# EAGLE schematic trig3_board_marc1_de0-nano (EAGLE 9.5.2)
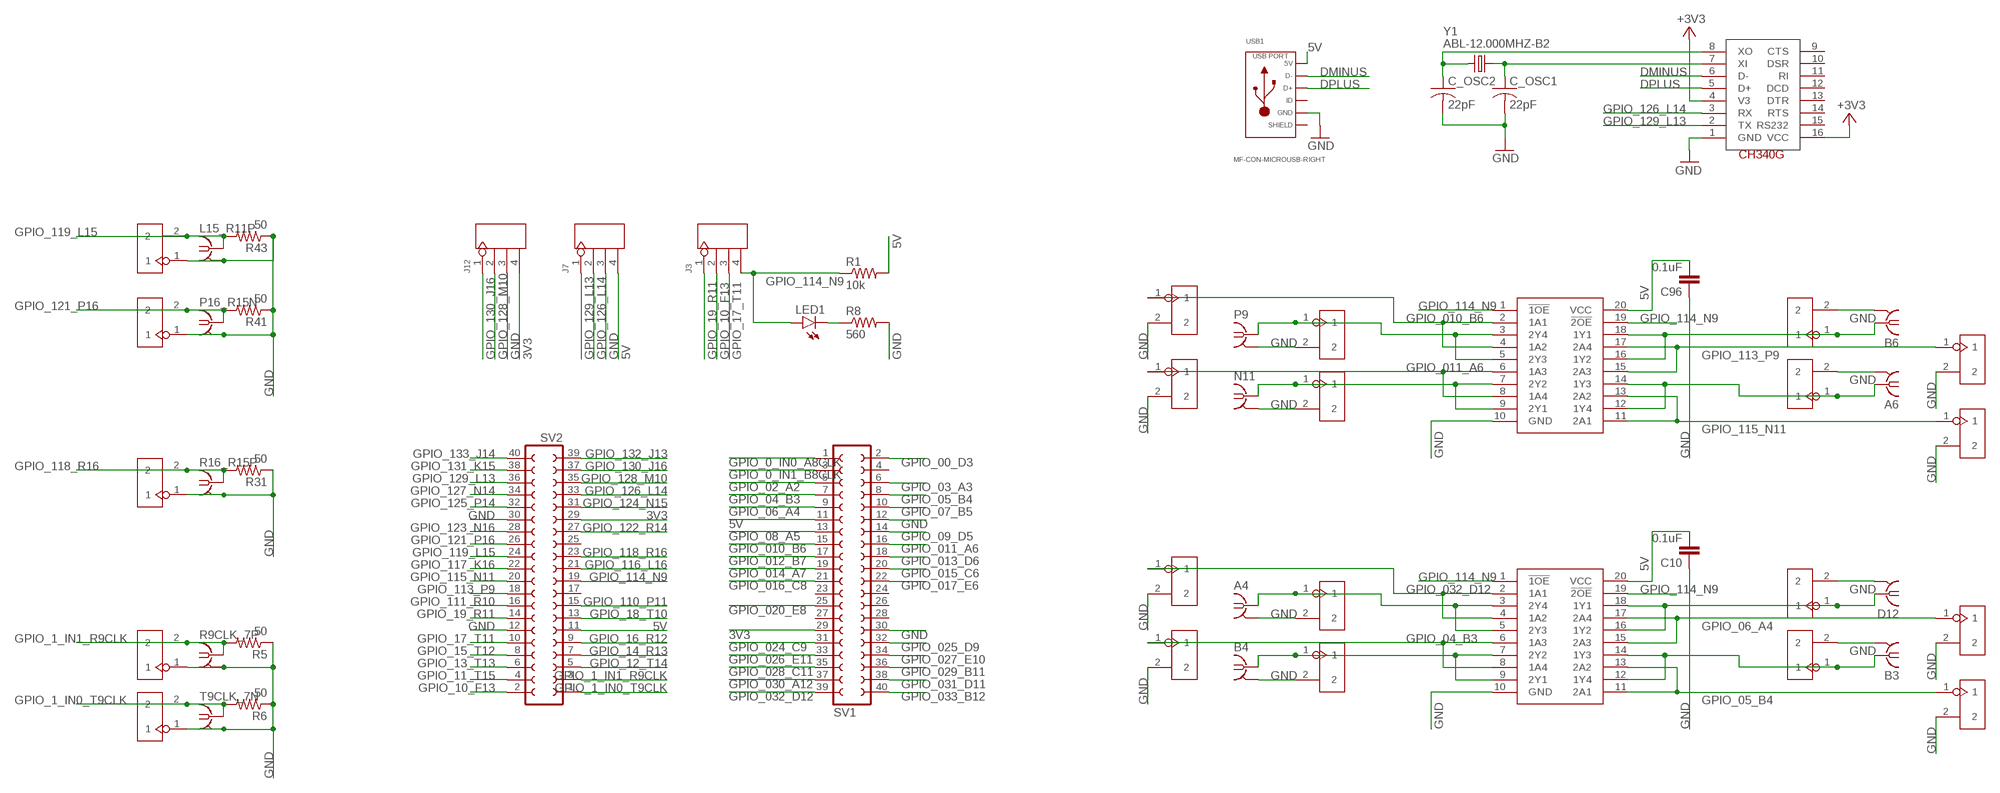
[diagram p0: schematic, sheet 1]

## Parts
A4  BU-SMB-V  [BU-SMB-V]
A6  BU-SMB-V  [BU-SMB-V]
B3  BU-SMB-V  [BU-SMB-V]
B4  BU-SMB-V  [BU-SMB-V]
B6  BU-SMB-V  [BU-SMB-V]
C10  0.1uF  CAP0805  [0805]
C96  0.1uF  CAP0805  [0805]
C_OSC1  22pF  C-USC0603  [C0603]
C_OSC2  22pF  C-USC0603  [C0603]
D12  BU-SMB-V  [BU-SMB-V]
J3  4p-2.54  DIP-BLACK-FEMALE-HEADER-VERT(4P-2.54)  [H4-2.54]
J5  2p-2.54  DIP-BLACK-MALE-HEADER-VERT(2P-2.54)  [H2-2.54]
J6  2p-2.54  DIP-BLACK-MALE-HEADER-VERT(2P-2.54)  [H2-2.54]
J7  4p-2.54  DIP-BLACK-FEMALE-HEADER-VERT(4P-2.54)  [H4-2.54]
J12  4p-2.54  DIP-BLACK-FEMALE-HEADER-VERT(4P-2.54)  [H4-2.54]
J34  2p-2.54  DIP-BLACK-MALE-HEADER-VERT(2P-2.54)  [H2-2.54]
J42  2p-2.54  DIP-BLACK-MALE-HEADER-VERT(2P-2.54)  [H2-2.54]
J43  2p-2.54  DIP-BLACK-MALE-HEADER-VERT(2P-2.54)  [H2-2.54]
L15_R11P  BU-SMB-V  [BU-SMB-V]
LED1  red  LEDCHIP-LED0805  [CHIP-LED0805]
N11  BU-SMB-V  [BU-SMB-V]
OJ41  2p-2.54  DIP-BLACK-MALE-HEADER-VERT(2P-2.54)  [H2-2.54]
OJ42  2p-2.54  DIP-BLACK-MALE-HEADER-VERT(2P-2.54)  [H2-2.54]
OJ43  2p-2.54  DIP-BLACK-MALE-HEADER-VERT(2P-2.54)  [H2-2.54]
OJ44  2p-2.54  DIP-BLACK-MALE-HEADER-VERT(2P-2.54)  [H2-2.54]
OJ45  2p-2.54  DIP-BLACK-MALE-HEADER-VERT(2P-2.54)  [H2-2.54]
OJ46  2p-2.54  DIP-BLACK-MALE-HEADER-VERT(2P-2.54)  [H2-2.54]
OJ47  2p-2.54  DIP-BLACK-MALE-HEADER-VERT(2P-2.54)  [H2-2.54]
OJ48  2p-2.54  DIP-BLACK-MALE-HEADER-VERT(2P-2.54)  [H2-2.54]
OJ89  2p-2.54  DIP-BLACK-MALE-HEADER-VERT(2P-2.54)  [H2-2.54]
OJ90  2p-2.54  DIP-BLACK-MALE-HEADER-VERT(2P-2.54)  [H2-2.54]
OJ91  2p-2.54  DIP-BLACK-MALE-HEADER-VERT(2P-2.54)  [H2-2.54]
OJ92  2p-2.54  DIP-BLACK-MALE-HEADER-VERT(2P-2.54)  [H2-2.54]
OJ93  2p-2.54  DIP-BLACK-MALE-HEADER-VERT(2P-2.54)  [H2-2.54]
OJ94  2p-2.54  DIP-BLACK-MALE-HEADER-VERT(2P-2.54)  [H2-2.54]
OJ95  2p-2.54  DIP-BLACK-MALE-HEADER-VERT(2P-2.54)  [H2-2.54]
OJ96  2p-2.54  DIP-BLACK-MALE-HEADER-VERT(2P-2.54)  [H2-2.54]
P9  BU-SMB-V  [BU-SMB-V]
P16_R15N  BU-SMB-V  [BU-SMB-V]
R1  10k  R-US_R0805  [R0805]
R5  50  RESISTORAXIAL-0.3  [AXIAL-0.3]
R6  50  RESISTORAXIAL-0.3  [AXIAL-0.3]
R8  560  R-US_R0805  [R0805]
R9CLK_7P  BU-SMB-V  [BU-SMB-V]
R16_R15P  BU-SMB-V  [BU-SMB-V]
R31  50  RESISTORAXIAL-0.3  [AXIAL-0.3]
R41  50  RESISTORAXIAL-0.3  [AXIAL-0.3]
R43  50  RESISTORAXIAL-0.3  [AXIAL-0.3]
SV1  FE20-2  [FE20-2]
SV2  FE20-2  [FE20-2]
T9CLK_7N  BU-SMB-V  [BU-SMB-V]
U340G  CH340G  [SOIC16]
USB1  MF-CON-MICROUSB-RIGHT  USB_5PIN_10118193-0001LF  [10118193-0001LF]
VSLUE5  SN74ACT244DW  [SOIC127P1030X265-20N]
VSLUE11  SN74ACT244DW  [SOIC127P1030X265-20N]
Y1  ABL-12.000MHZ-B2  CRYSTALHC49US  [HC49US]

## Nets
3V3 [power]: J12.4 SV1.29 SV2.29
5V [power]: C10.2 C96.2 J7.4 R1.2 SV1.11 SV2.11 USB1.1(5V) VSLUE5.20(VCC) VSLUE11.20(VCC)
+3V3 [three]: U340G.4(V3) U340G.16(VCC)
DMINUS: U340G.6(D-) USB1.2(D-)
DPLUS: U340G.5(D+) USB1.3(D+)
GND: A4.2 A4.3 A4.4 A4.5 A6.2 A6.3 A6.4 A6.5 B3.2 B3.3 B3.4 B3.5 B4.2 B4.3 B4.4 B4.5 B6.2 B6.3 B6.4 B6.5 C10.1 C96.1 C_OSC1.2 C_OSC2.2 D12.2 D12.3 D12.4 D12.5 J5.1 J6.1 J7.3 J12.3 J34.1 J42.1 J43.1 L15_R11P.2 L15_R11P.3 L15_R11P.4 L15_R11P.5 N11.2 N11.3 N11.4 N11.5 OJ41.2 OJ42.2 OJ43.2 OJ44.2 OJ45.2 OJ46.2 OJ47.2 OJ48.2 OJ89.2 OJ90.2 OJ91.2 OJ92.2 OJ93.2 OJ94.2 OJ95.2 OJ96.2 P9.2 P9.3 P9.4 P9.5 P16_R15N.2 P16_R15N.3 P16_R15N.4 P16_R15N.5 R5.P$1 R6.P$1 R8.2 R9CLK_7P.2 R9CLK_7P.3 R9CLK_7P.4 R9CLK_7P.5 R16_R15P.2 R16_R15P.3 R16_R15P.4 R16_R15P.5 R31.P$1 R41.P$1 R43.P$1 SV1.12 SV1.30 SV2.12 SV2.30 T9CLK_7N.2 T9CLK_7N.3 T9CLK_7N.4 T9CLK_7N.5 U340G.1(GND) USB1.5(GND) VSLUE5.10(GND) VSLUE11.10(GND)
GPIO_00_D3: SV1.2
GPIO_0_IN0_A8CLK: SV1.1
GPIO_0_IN1_B8CLK: SV1.3
GPIO_1_IN0_T9CLK: J6.2 R6.P$2 SV2.1 T9CLK_7N.1
GPIO_1_IN1_R9CLK: J5.2 R5.P$2 R9CLK_7P.1 SV2.3
GPIO_02_A2: SV1.5
GPIO_03_A3: SV1.6
GPIO_04_B3: OJ96.1 SV1.7 VSLUE11.6(1A3) VSLUE11.8(1A4)
GPIO_05_B4: OJ94.1 SV1.8 VSLUE11.11(2A1) VSLUE11.13(2A2)
GPIO_06_A4: OJ93.1 SV1.9 VSLUE11.15(2A3) VSLUE11.17(2A4)
GPIO_07_B5: SV1.10
GPIO_08_A5: SV1.13
GPIO_09_D5: SV1.14
GPIO_010_B6: OJ47.1 SV1.15 VSLUE5.2(1A1) VSLUE5.4(1A2)
GPIO_10_F13: J3.2 SV2.2
GPIO_011_A6: OJ48.1 SV1.16 VSLUE5.6(1A3) VSLUE5.8(1A4)
GPIO_11_T15: SV2.4
GPIO_012_B7: SV1.17
GPIO_12_T14: SV2.5
GPIO_013_D6: SV1.18
GPIO_13_T13: SV2.6
GPIO_014_A7: SV1.19
GPIO_14_R13: SV2.7
GPIO_015_C6: SV1.20
GPIO_15_T12: SV2.8
GPIO_016_C8: SV1.21
GPIO_16_R12: SV2.9
GPIO_017_E6: SV1.22
GPIO_17_T11: J3.3 SV2.10
GPIO_18_T10: SV2.13
GPIO_19_R11: J3.1 SV2.14
GPIO_020_E8: SV1.25
GPIO_024_C9: SV1.31
GPIO_025_D9: SV1.32
GPIO_026_E11: SV1.33
GPIO_027_E10: SV1.34
GPIO_028_C11: SV1.35
GPIO_029_B11: SV1.36
GPIO_030_A12: SV1.37
GPIO_031_D11: SV1.38
GPIO_032_D12: OJ95.1 SV1.39 VSLUE11.2(1A1) VSLUE11.4(1A2)
GPIO_033_B12: SV1.40
GPIO_110_P11: SV2.15
GPIO_111_R10: SV2.16
GPIO_113_P9: OJ45.1 SV2.18 VSLUE5.15(2A3) VSLUE5.17(2A4)
GPIO_114_N9: J3.4 LED1.A R1.1 SV2.19 VSLUE5.1(!1OE) VSLUE5.19(!2OE) VSLUE11.1(!1OE) VSLUE11.19(!2OE)
GPIO_115_N11: OJ46.1 SV2.20 VSLUE5.11(2A1) VSLUE5.13(2A2)
GPIO_116_L16: SV2.21
GPIO_117_K16: SV2.22
GPIO_118_R16: J34.2 R16_R15P.1 R31.P$2 SV2.23
GPIO_119_L15: J43.2 L15_R11P.1 R43.P$2 SV2.24
GPIO_121_P16: J42.2 P16_R15N.1 R41.P$2 SV2.26
GPIO_122_R14: SV2.27
GPIO_123_N16: SV2.28
GPIO_124_N15: SV2.31
GPIO_125_P14: SV2.32
GPIO_126_L14: J7.2 SV2.33 U340G.3(RX)
GPIO_127_N14: SV2.34
GPIO_128_M10: J12.2 SV2.35
GPIO_129_L13: J7.1 SV2.36 U340G.2(TX)
GPIO_130_J16: J12.1 SV2.37
GPIO_131_K15: SV2.38
GPIO_132_J13: SV2.39
GPIO_133_J14: SV2.40
N$9: LED1.C R8.1
N$23: C_OSC1.1 U340G.7(XI) Y1.1
N$31: C_OSC2.1 U340G.8(XO) Y1.2
OUT21: B6.1 OJ44.1 VSLUE5.16(1Y2) VSLUE5.18(1Y1)
OUT22: A6.1 OJ43.1 VSLUE5.12(1Y4) VSLUE5.14(1Y3)
OUT23: OJ41.1 P9.1 VSLUE5.3(2Y4) VSLUE5.5(2Y3)
OUT24: N11.1 OJ42.1 VSLUE5.7(2Y2) VSLUE5.9(2Y1)
OUT45: D12.1 OJ92.1 VSLUE11.16(1Y2) VSLUE11.18(1Y1)
OUT46: B3.1 OJ91.1 VSLUE11.12(1Y4) VSLUE11.14(1Y3)
OUT47: A4.1 OJ89.1 VSLUE11.3(2Y4) VSLUE11.5(2Y3)
OUT48: B4.1 OJ90.1 VSLUE11.7(2Y2) VSLUE11.9(2Y1)
Unconnected: SV1.4 SV1.23 SV1.24 SV1.26 SV1.27 SV1.28 SV2.17 SV2.25 U340G.9(CTS) U340G.10(DSR) U340G.11(RI) U340G.12(DCD) U340G.13(DTR) U340G.14(RTS) U340G.15(RS232) USB1.4(ID)

## Power pins joined to a net without a drawn wire
SLD: USB1.S1(SLD) USB1.S2(SLD) USB1.S3(SLD) USB1.S4(SLD)

## Library data of the parts
A4 A6 B3 B4 B6 D12 L15_R11P N11 P9 P16_R15N R9CLK_7P R16_R15P T9CLK_7N = con-coax:BU-SMB-V: FEMALE SMB CONNECTOR Radiall distributor RS 112-2993; OC_FARNELL: unknown; OC_NEWARK: unknown
C10 C96 = SparkFun-Capacitors:CAP: Capacitor Standard 0603 ceramic capacitor, and 0.1" leaded capacitor.
C_OSC1 C_OSC2 = rcl@1:C-US: CAPACITOR, American symbol; MFN: MF-CAP-0603-22pF
J3 J7 J12 = Seeed-Connector:DIP-BLACK-FEMALE-HEADER-VERT(4P-2.54): 320030017; MPN: F185-1104A1BSYA1
J5 J6 J34 J42 J43 OJ41-OJ48 OJ89-OJ96 = Seeed-Connector:DIP-BLACK-MALE-HEADER-VERT(2P-2.54): 320020016; MPN: P125-1102A0BS116A1
LED1 = led:LED: LED OSRAM: - CHIPLED LG R971, LG N971, LY N971, LG Q971, LY Q971, LO R971, LY R971 LH N974, LH R974 LS Q976, LO Q976, LY Q976 LO Q996 - Hyper CHIPLED LW Q18S LB Q993, LB Q99A, LB R99A - SideLED LS A670, LO A670, LY A670, LG A670, LP A670 LB A673, LV A673, LT A673, LW A673 LH A674 LY A675 LS A676, LA A676, LO A676, LY A676, LW A676 LS A679, LY A679, LG A679 - Hyper Micro SIDELED® LS Y876, LA Y876, LO Y876, LY Y876 LT Y87S - SmartLED LW L88C, LW L88S LB L89C, LB L89S, LG L890 LS L89K, LO L89K, LY L89K LS L896, LA L896, LO L896, LY L896 - TOPLED LS T670, LO T670, LY T670, LG T670, LP T670 LSG T670, LSP T670, LSY T670, LOP T670, LYG T670 LG T671, LOG T671, LSG T671 LB T673, LV T673, LT T673, LW T673 LH T674 LS T676, LA T676, LO T676, LY T676, LB T676, LH T676, LSB T676, LW T676 LB T67C, LV T67C, LT T67C, LS T67K, LO T67K, LY T67K, LW E67C LS E67B, LA E67B, LO E67B, LY E67B, LB E67C, LV E67C, LT E67C LW T67C LS T679, LY T679, LG T679 LS T770, LO T770, LY T770, LG T770, LP T770 LB T773, LV T773, LT T773, LW T773 LH T774 LS E675, LA E675, LY E675, LS T675 LS T776, LA T776, LO T776, LY T776, LB T776 LHGB T686 LT T68C, LB T68C - Hyper Mini TOPLED® LB M676 - Mini TOPLED Santana® LG M470 LS M47K, LO M47K, LY M47K Source: http://www.osram.convergy.de LUXEON: - LUMILED® LXK2-PW12-R00, LXK2-PW12-S00, LXK2-PW14-U00, LXK2-PW14-V00 LXK2-PM12-R00, LXK2-PM12-S00, LXK2-PM14-U00 LXK2-PE12-Q00, LXK2-PE12-R00, LXK2-PE12-S00, LXK2-PE14-T00, LXK2-PE14-U00 LXK2-PB12-K00, LXK2-PB12-L00, LXK2-PB12-M00, LXK2-PB14-N00, LXK2-PB14-P00, LXK2-PB14-Q00 LXK2-PR12-L00, LXK2-PR12-M00, LXK2-PR14-Q00, LXK2-PR14-R00 LXK2-PD12-Q00, LXK2-PD12-R00, LXK2-PD12-S00 LXK2-PH12-R00, LXK2-PH12-S00 LXK2-PL12-P00, LXK2-PL12-Q00, LXK2-PL12-R00 Source: www.luxeon.com KINGBRIGHT: KA-3528ASYC Source: www.kingbright.com
R1 = adafruit:R-US_: RESISTOR, American symbol
R5 R6 R31 R41 R43 = SparkFun-Passives:RESISTOR: Resistor Basic schematic elements and footprints for 0603, 1206, and PTH resistors.
R8 = resistor:R-US_: RESISTOR, American symbol
SV1 SV2 = con-lsta:FE20-2: FEMALE HEADER; OC_FARNELL: unknown; OC_NEWARK: unknown
U340G = usb-serial:CH340G
USB1 = PP_Connectors:USB_5PIN; POPULATE: 1
VSLUE5 VSLUE11 = SN74ACT244DW:SN74ACT244DW: SN74ACT244DW, 8-Bit Buffer, Line Driver, ACT, 3-State Non-Inverting 4.5 5.5 V 20-Pin SOIC Source: Datasheet <http://www.ti.com/lit/ds/symlink/sn74act244.pdf>; ARROW_PART_NUMBER: SN74ACT244DW; ARROW_PRICE-STOCK: https://www.arrow.com/en/products/sn74act244dw/texas-instruments; DESCRIPTION: SN74ACT244DW, 8-Bit Buffer, Line Driver, ACT, 3-State Non-Inverting 4.5 5.5 V 20-Pin SOIC; HEIGHT: 2.65mm; MANUFACTURER_NAME: Texas Instruments; MANUFACTURER_PART_NUMBER: SN74ACT244DW; RS_PART_NUMBER: 4363169; RS_PRICE-STOCK: http://uk.rs-online.com/web/p/products/4363169
Y1 = SparkFun-FreqCtrl:CRYSTAL: Various standard crystals. Proven footprints.

## Net classes
0 default: width 0.254 mm
1 power: width 0.762 mm
2 three: width 0.152 mm
3 five: width 0.381 mm